# Altium schematic sheet Block Diagram.SchDoc: EEG Measurement Circuit
size A3; Date: 24/01/2025; DrawnBy: Giang Phan Truong; Revision: 1.1.0; SheetNumber: 1; SheetTotal: 7
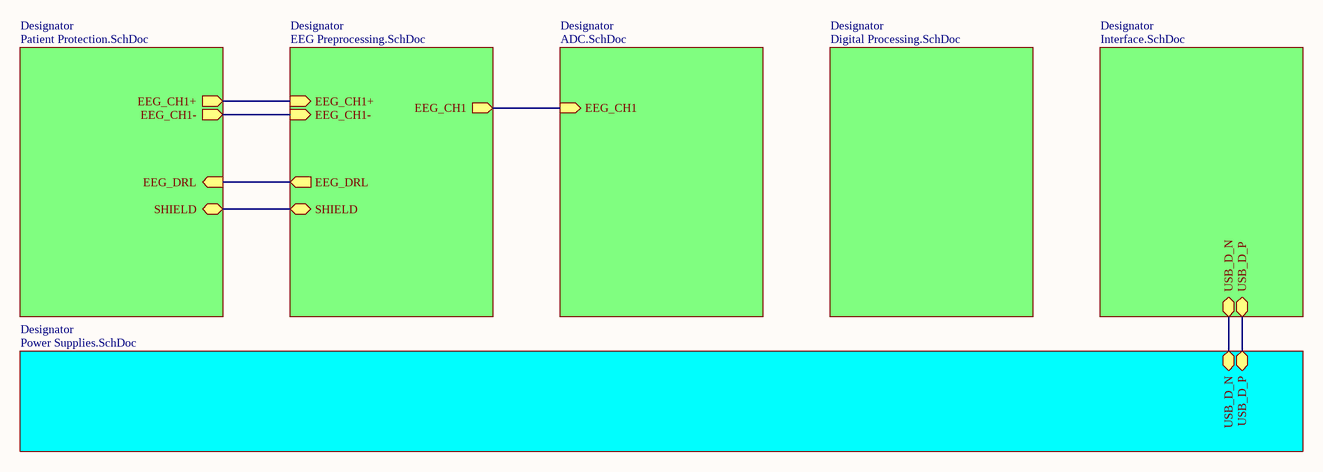
[diagram p0: Block Diagram.SchDoc]

## Sub-sheets
Designator = Power Supplies.SchDoc: USB_D_N (bidir), USB_D_P (bidir)
Designator = EEG Preprocessing.SchDoc: EEG_CH1+ (in), EEG_CH1- (in), EEG_CH1 (out), EEG_DRL (out), SHIELD (bidir)
Designator = ADC.SchDoc: EEG_CH1 (in)
Designator = Digital Processing.SchDoc: no entries
Designator = Interface.SchDoc: USB_D_P (bidir), USB_D_N (bidir)
Designator = Patient Protection.SchDoc: EEG_CH1+ (out), EEG_CH1- (out), EEG_DRL (in), SHIELD (bidir)

## Nets
(unnamed): sheet Designator/USB_D_N, sheet Designator/USB_D_N
(unnamed): sheet Designator/USB_D_P, sheet Designator/USB_D_P
(unnamed): sheet Designator/EEG_CH1+, sheet Designator/EEG_CH1+
(unnamed): sheet Designator/EEG_CH1-, sheet Designator/EEG_CH1-
(unnamed): sheet Designator/EEG_CH1, sheet Designator/EEG_CH1
(unnamed): sheet Designator/EEG_DRL, sheet Designator/EEG_DRL
(unnamed): sheet Designator/SHIELD, sheet Designator/SHIELD

## Notes on the sheet
- Project Name:
- Size
- Size:
- A3
- Revision:
- Drawn By:
- Date:
- File:
- Last Modified:
- Checked By:
- Sheet
- of